# Altium schematic sheet 10X SD CARD READER SCH SHEET 4.SchDoc
size A3
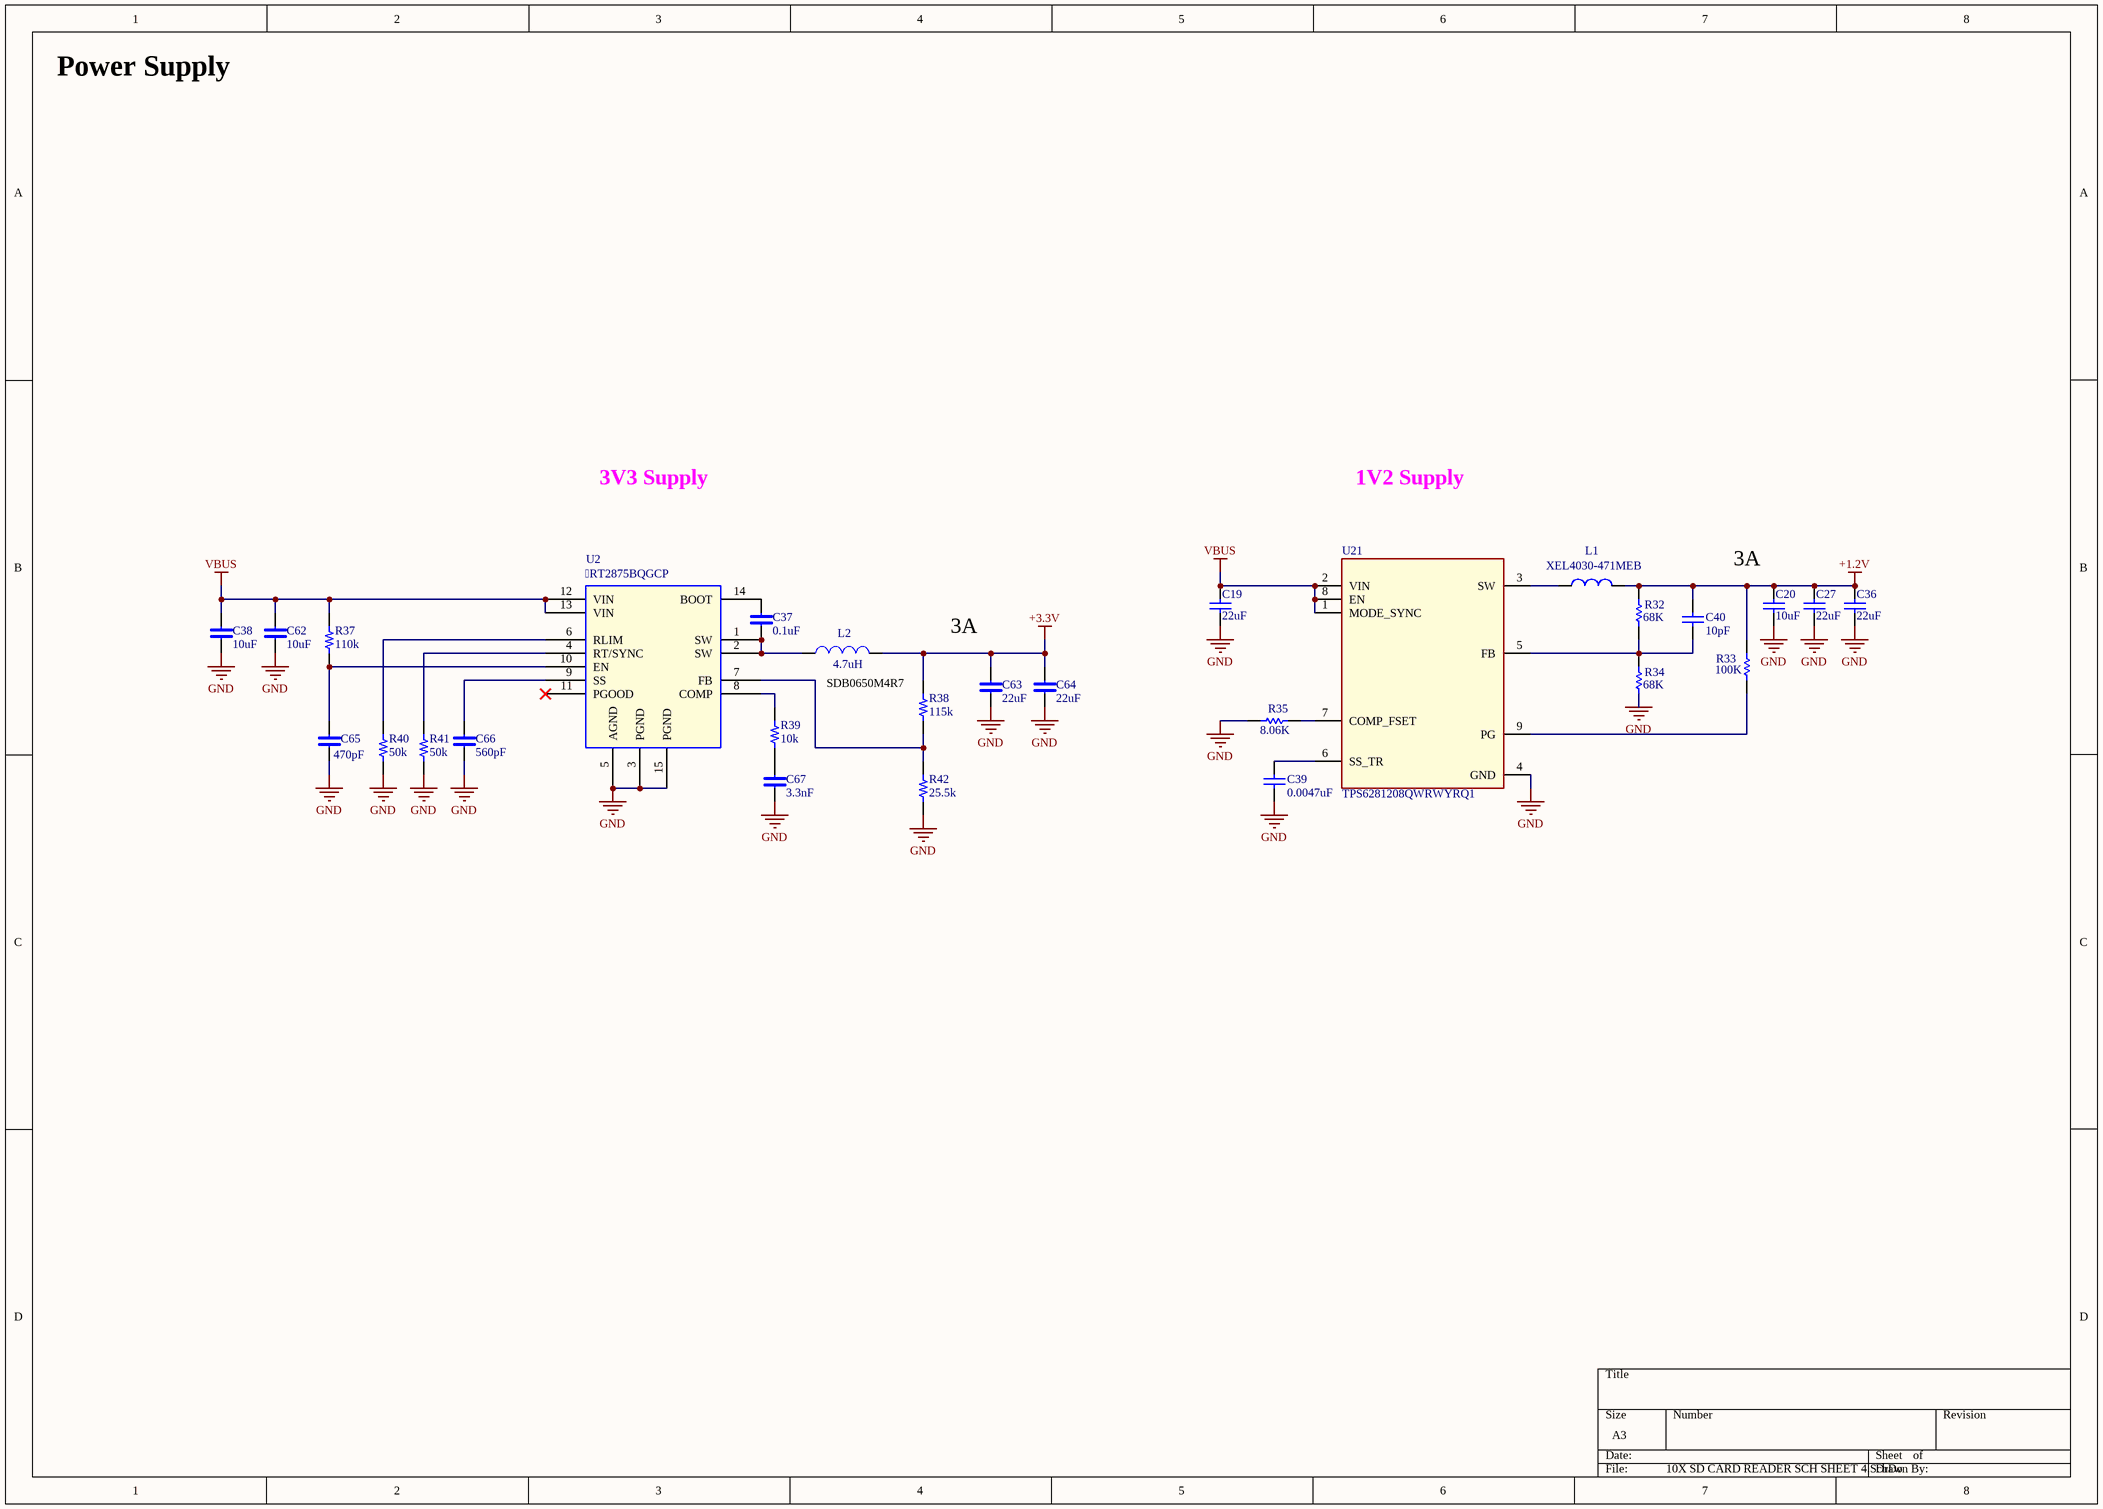
[diagram p0: 10X SD CARD READER SCH SHEET 4.SchDoc]

## Parts
C19  22uF  [CAPC3216X180N]
C20  10uF  [CAPC1608X100N]
C27  22uF  [CAPC3216X180N]
C36  22uF  [CAPC3216X180N]
C37  0.1uF  [C-0402/1005]
C38  10uF  [C-1206/3216]
C39  value 0.0047uF  [C-0402/1005]  (hidden comment: 0.1uF)
C40  value 10pF  [C-0402/1005]  (hidden comment: 0.1uF)
C62  10uF  [C-1206/3216]
C63  22uF  [C-1206/3216]
C64  22uF  [C-1206/3216]
C65  470pF  [C-0402/1005]
C66  560pF  [C-0402/1005]
C67  3.3nF  [C-0402/1005]
L1  XEL4030-471MEB  [IND_XEL4030_3.1_COC]
L2  4.7uH  [IND_SPM6550T-4R7M]
R32  68K  [R-0402/1005]
R33  100K  [R-0402/1005]
R34  68K  [R-0402/1005]
R35  8.06K  [R-0402/1005]
R37  110k  [R-0402/1005]
R38  115k  [R-0402/1005]
R39  10k  [R-0402/1005]
R40  50k  [R-0402/1005]
R41  50k  [R-0402/1005]
R42  25.5k  [R-0402/1005]
U2  RT2875BQGCP  [TSSOP-14]
U21  TPS6281208QWRWYRQ1  [RWY0009A]

## Nets
+1.2V: C20.2 C27.2 C36.2 C40.1 L1.2 R32.2 R33.2
+3.3V: C63.1 C64.1 L2.2 R38.2
GND: C19.1 C20.1 C27.1 C36.1 C38.1 C39.2 C62.1 C63.2 C64.2 C65.1 C66.1 C67.1 R34.1 R35.2 R40.1 R41.1 R42.1 U2.3(PGND) U2.5(AGND) U2.15(PGND) U21.4(GND)
VBUS: C19.2 C38.2 C62.2 R37.2 U2.12(VIN) U2.13(VIN) U21.1(MODE_SYNC) U21.2(VIN) U21.8(EN)
NetC37_1: C37.1 L2.1 U2.1(SW) U2.2(SW)
NetC37_2: C37.2 U2.14(BOOT)
NetC39_1: C39.1 U21.6(SS_TR)
NetC40_2: C40.2 R32.1 R34.2 U21.5(FB)
NetC65_2: C65.2 R37.1 U2.10(EN)
NetC66_2: C66.2 U2.9(SS)
NetC67_2: C67.2 R39.1
NetL1_1: L1.1 U21.3(SW)
NetR33_1: R33.1 U21.9(PG)
NetR35_1: R35.1 U21.7(COMP_FSET)
NetR38_1: R38.1 R42.2 U2.7(FB)
NetR39_2: R39.2 U2.8(COMP)
NetR40_2: R40.2 U2.6(RLIM)
NetR41_2: R41.2 U2.4(RT/SYNC)

Not connected (* = marked no-connect by the designer): U2 11(PGOOD)*

## Notes on the sheet
- Power Supply
- 3V3 Supply
- 1V2 Supply
- (near C20) 3A
- 3A
- SDB0650M4R7

## Library data of the parts
C19 C20 C27 C36 = Cap: Capacitor; Value: 0.1uF; Published: 8-Jun-2000; LatestRevisionDate: 17-Jul-2002; LatestRevisionNote: Re-released for DXP Platform.; PackageReference: RAD-0.3; Publisher: Altium Limited; PackageDescription: Radial Cap, Thru-Hole; 2 Leads; 0.3 in Pin Spacing
C37 C38 C62 C65-C67 = CAP 1206/3216: CAP CER 10UF 25V X5R 1206; Mfr. Part No.: C1206C106M3PACTU; Unit Price (USD): 0.28; Supplier Part No.: 399-8153-1-ND; Supplier: Digikey Electronics
C39 C40 = Cap: Capacitor; Published: 8-Jun-2000; LatestRevisionDate: 17-Jul-2002; LatestRevisionNote: Re-released for DXP Platform.; PackageReference: RAD-0.3; Publisher: Altium Limited; PackageDescription: Radial Cap, Thru-Hole; 2 Leads; 0.3 in Pin Spacing
C63 C64 = Capacitor-NonPolar: CAP CER 0.1UF 50V X7R 0402; Mfr. Part No.: UMK105B7104KV-FR; Value: 100nF; Unit Price (USD): 0.15; Supplier Part No.: 587-3498-1-ND; Supplier: Digikey Electronics
L1 = LQM21PN1R0MC0D: Inductor with Inductance: 1uH Tol. +/-20%, Package: 0805 _2012_; MF: Murata; MP: LQM21PN1R0MC0D; Price: None; SnapEDA_Link: https://www.snapeda.com/parts/LQM21PN1R0MC0D/Murata%20Electronics%20North%20America/view-part/51550/?ref=snap; Package: 2012 Murata; Value: *; Availability: Unavailable
L2 = INDUCTOR_2: Power inductor 4.7uH Isat=7A; Manufacturer Name: VIKING; Manufacturer P/N: SDB0650M4R7; SolidRun P/N: IN00045; MFG_PN01: SDB0650MT4R7; PCB Footprint: SDB0650; Updated: 2016-02-10 17:13:33; Manufacturer: VIKING; MFG_NAME01: VIKING; Datasheet: www.viking.com.tw/ftp/SDB.pdf; PRIORITY_PN: IN00045
R32-R35 = Res1: Resistor; Value: 10K; Published: 8-Jun-2000; LatestRevisionDate: 17-Jul-2002; LatestRevisionNote: Re-released for DXP Platform.; PackageReference: AXIAL-0.3; Publisher: Altium Limited; PackageDescription: Axial Device, Thru-Hole; 2 Leads; 0.3 in Pin Spacing
R37-R42 = Resistor: RES SMD 51 OHM 0.5% 1/16W 0402; Mfr. Part No.: ERA-2AED510X; Value: 51R; Unit Price (USD): 0.21; Supplier Part No.: P51DECT-ND; Supplier: Digikey Electronics
U2 = RT2875A/B: DC2DC chip; Manufacturer: RICHTECK; SolidRun P/N: IC00566; Manufacturer P/N: RT2875B; DataSheet: http://www.richtek.com/download_ds.jsp?p=RT2875A/RT2875B; Updated: 2016-02-10 17:13:33; PCB Footprint: TSSOP-14; Manufacturer Name: RICHTECK
U21 = TPS6281208QWRWYRQ1: No Description Available; Mfr_Name: Texas Instruments; Type: DEV; RefDes: RefDes; Copyright: Copyright (C) 2023 Ultra Librarian. All rights reserved.; Manufacturer_Part_Number: TPS6281208QWRWYRQ1; Digi-Key_Part_Number_1: 296-TPS6281208QWRWYRQ1TR-ND; Digi-Key_Part_Number_2: 296-TPS6281208QWRWYRQ1CT-ND; Digi-Key_Part_Number_3: 296-TPS6281208QWRWYRQ1DKR-ND